# EAGLE design CS-O-IBUZZER-3.3KHZ (EAGLE 6.5.0)
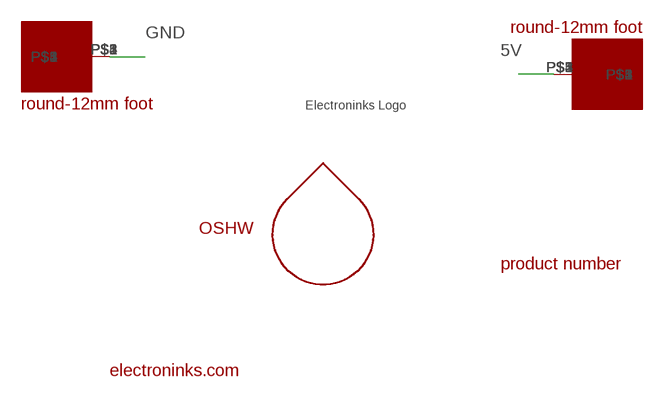
[diagram p0: schematic, sheet 1]

## Parts
U$1  ROUND-12MM-FOOT-1.8MM  [ROUND-12MM-FOOT]
U$2  ROUND-12MM-FOOT-1.8MM  [ROUND-12MM-FOOT]
U$3  ELECTRONINKS_LOGO_8MM  [ELECTRONINKS_LOGO_8MM]
U$4  ELECTRONINKS_COM_15MM  [ELECTRONINKS_COM_15MM]
U$5  DROPLET_LOGO_4MM  [DROPLET_LOGO_4MM]
U$6  OSHW_4MM  [OHSW_4MM]
U$7  CS_O_BUZZER_3.3KHZ  [CS_O_BUZZER_3.3KHZ]

## Nets
5V: U$2.P$1
GND: U$1.P$1
Unconnected: U$1.P$2 U$1.P$3 U$1.P$4 U$1.P$5 U$2.P$2 U$2.P$3 U$2.P$4 U$2.P$5

## Library data of the parts
U$1 U$2 = electroninks:ROUND-12MM-FOOT-1.8MM
U$3 = electroninks:ELECTRONINKS_LOGO_8MM
U$4 = electroninks:ELECTRONINKS_COM_15MM
U$5 = electroninks:DROPLET_LOGO_4MM
U$6 = electroninks:OSHW_4MM
U$7 = electroninks:CS_O_BUZZER_3.3KHZ

## Board
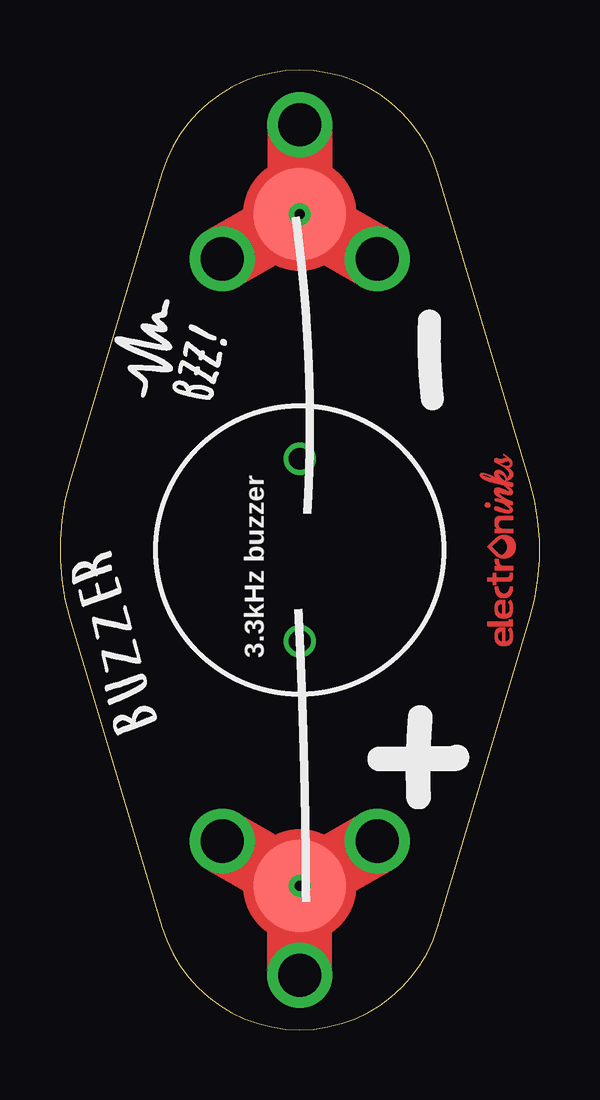
[diagram p1: board, top side]
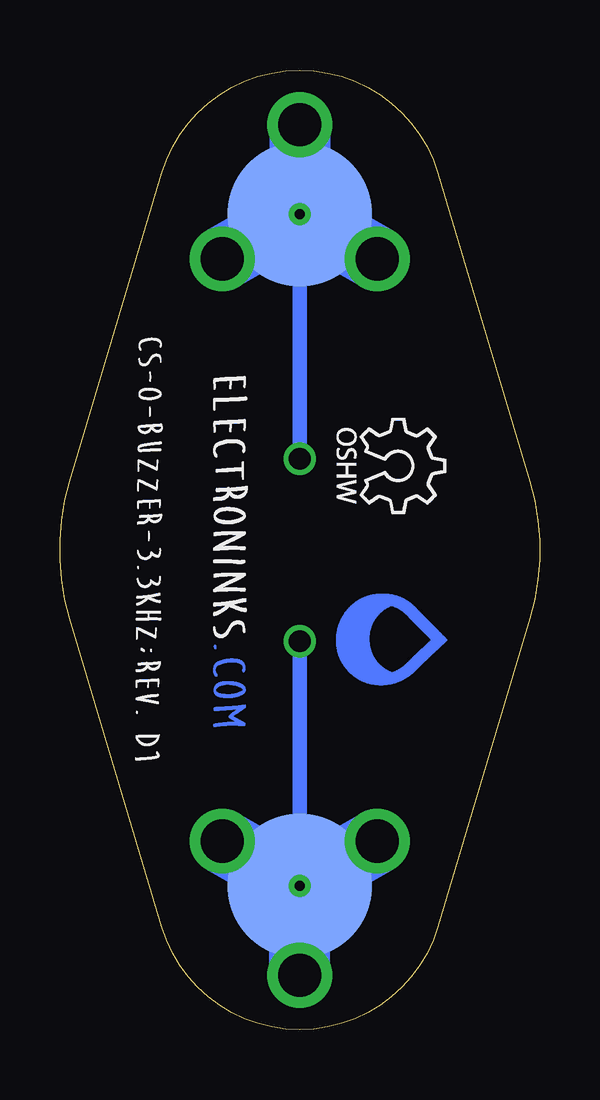
[diagram p2: board, bottom side, seen from below]

Size 19.98 x 40 mm. Coordinates in mm from the lower left corner, seen from the top.
Outline: 4.24,4.29 arc147 15.74,4.29 19.57,17.14 arc33 19.57,22.86 15.74,35.71 arc147 4.24,35.71 0.41,22.86 arc33 0.41,17.14 4.24,4.29
Copper layers (1*16): Top 0.035mm / dielectric 1.5mm / Bottom 0.035mm
Design rules "default": minimum track width 10mil, minimum drill 24mil, track to track 8mil, track to pad 8mil, pad to pad 8mil, via to via 8mil, smd to smd 8mil, copper to edge 40mil, drill to drill 8mil, minimum pad ring 10mil, minimum via ring 8mil, stop-mask expansion 4mil, vias tented up to drill 0mil, thermal gap 10mil

### Footprints (pad centres in the part's own frame; a part is rotated, then mirrored left to right if it is on the bottom)
ROUND-12MM-FOOT = drill 1.8: P$1 -3.726,0; P$2 1.863,3.227; P$3 1.863,-3.227 | smd 3.85 x 3.85: P$4 0,0 | smd 6 x 6 bottom: P$5 0,0 | drill 0.4: P$6 0,0

### Placement (x,y rotation side)
U$1  9.99,6 90 top
U$2  9.99,34 270 top
U$3  18.99,16 90 top
U$4  13.99,27.5 270 bottom
U$5  6.99,16.25 270 bottom
U$6  8.74,25.5 270 bottom
U$7  16.99,29 269.5 bottom

### Tracks (layer width: path | path; a pad name or v marks a point on that pad's centre or on a via)
5V  (via drill 0.9)
  Bottom 0.61: v9.99,23.8 9.99,34
GND  (via drill 0.9)
  Bottom 0.61: v9.99,16.2 9.99,6

### Text on the board
tPlace: 3.3kHz buzzer